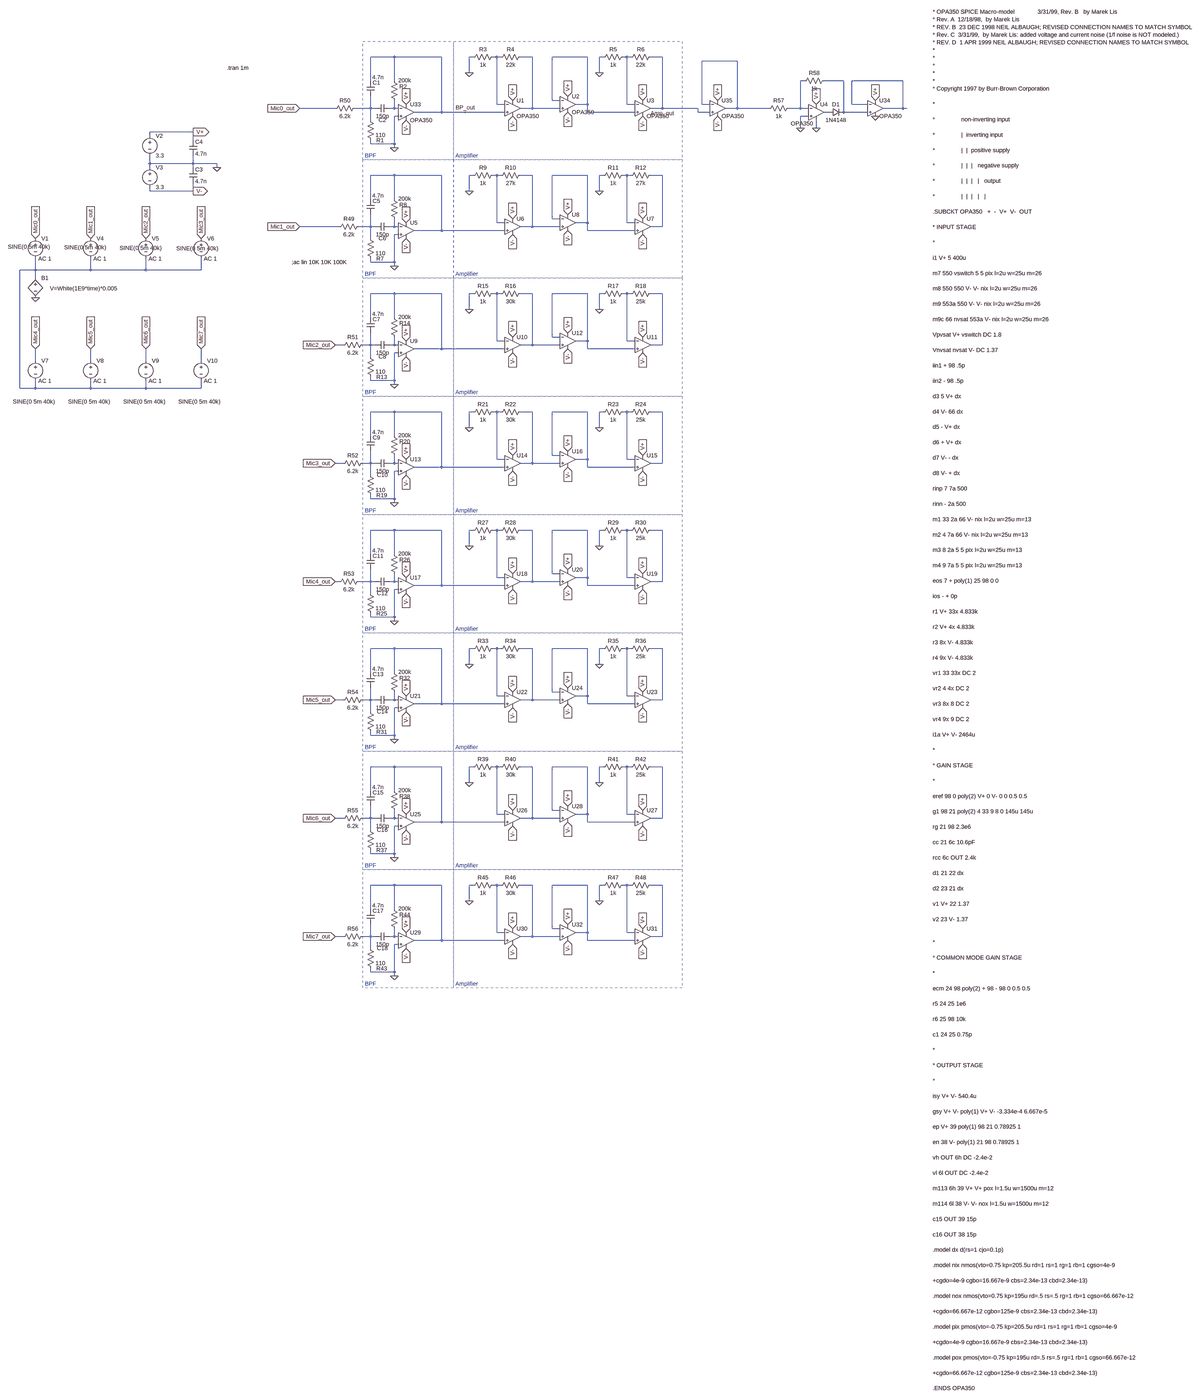
[diagram p0: schematic V00_CircuitDiagram.asc, whole sheet]
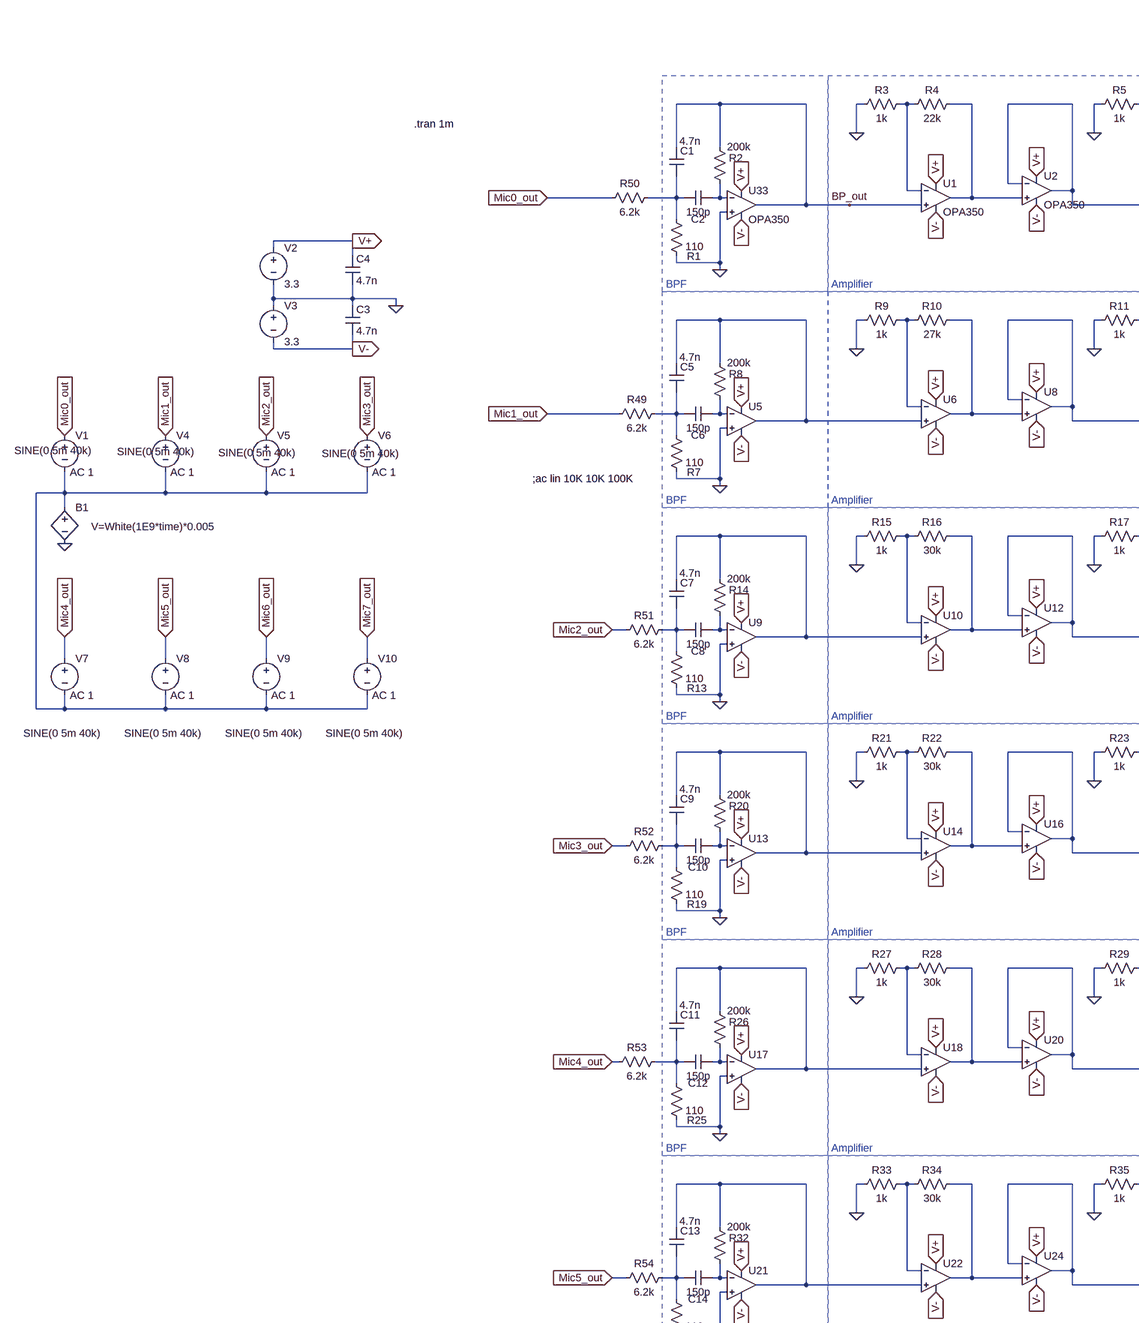
[diagram p1: schematic V00_CircuitDiagram.asc, part, row 1 of 2, column 1 of 2]
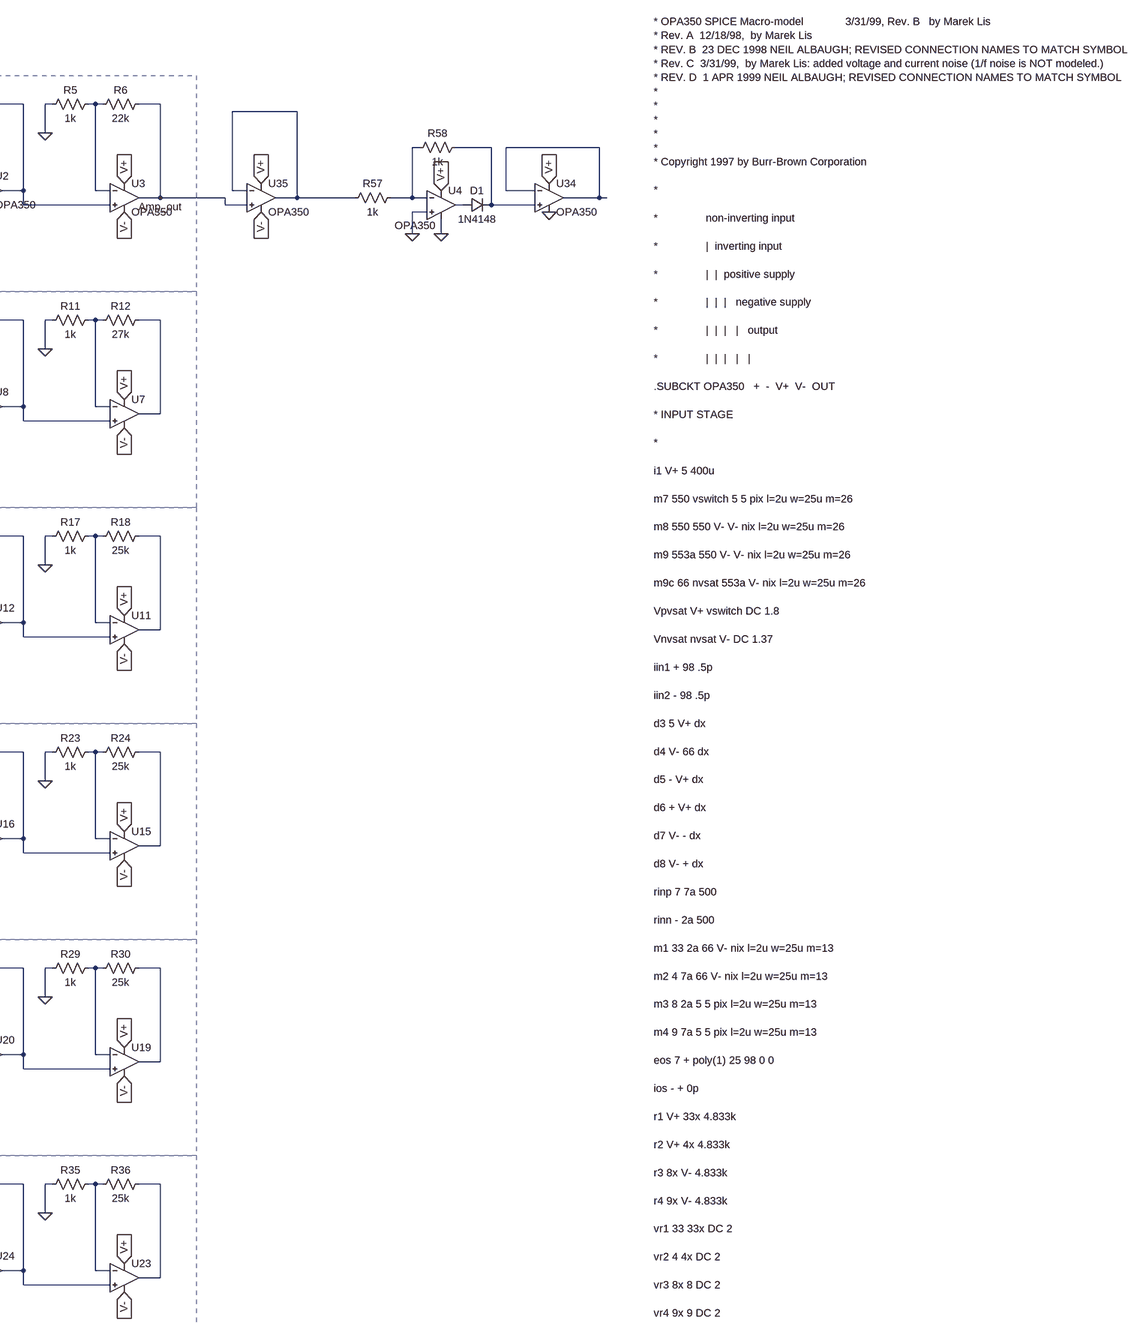
[diagram p2: schematic V00_CircuitDiagram.asc, part, row 1 of 2, column 2 of 2]
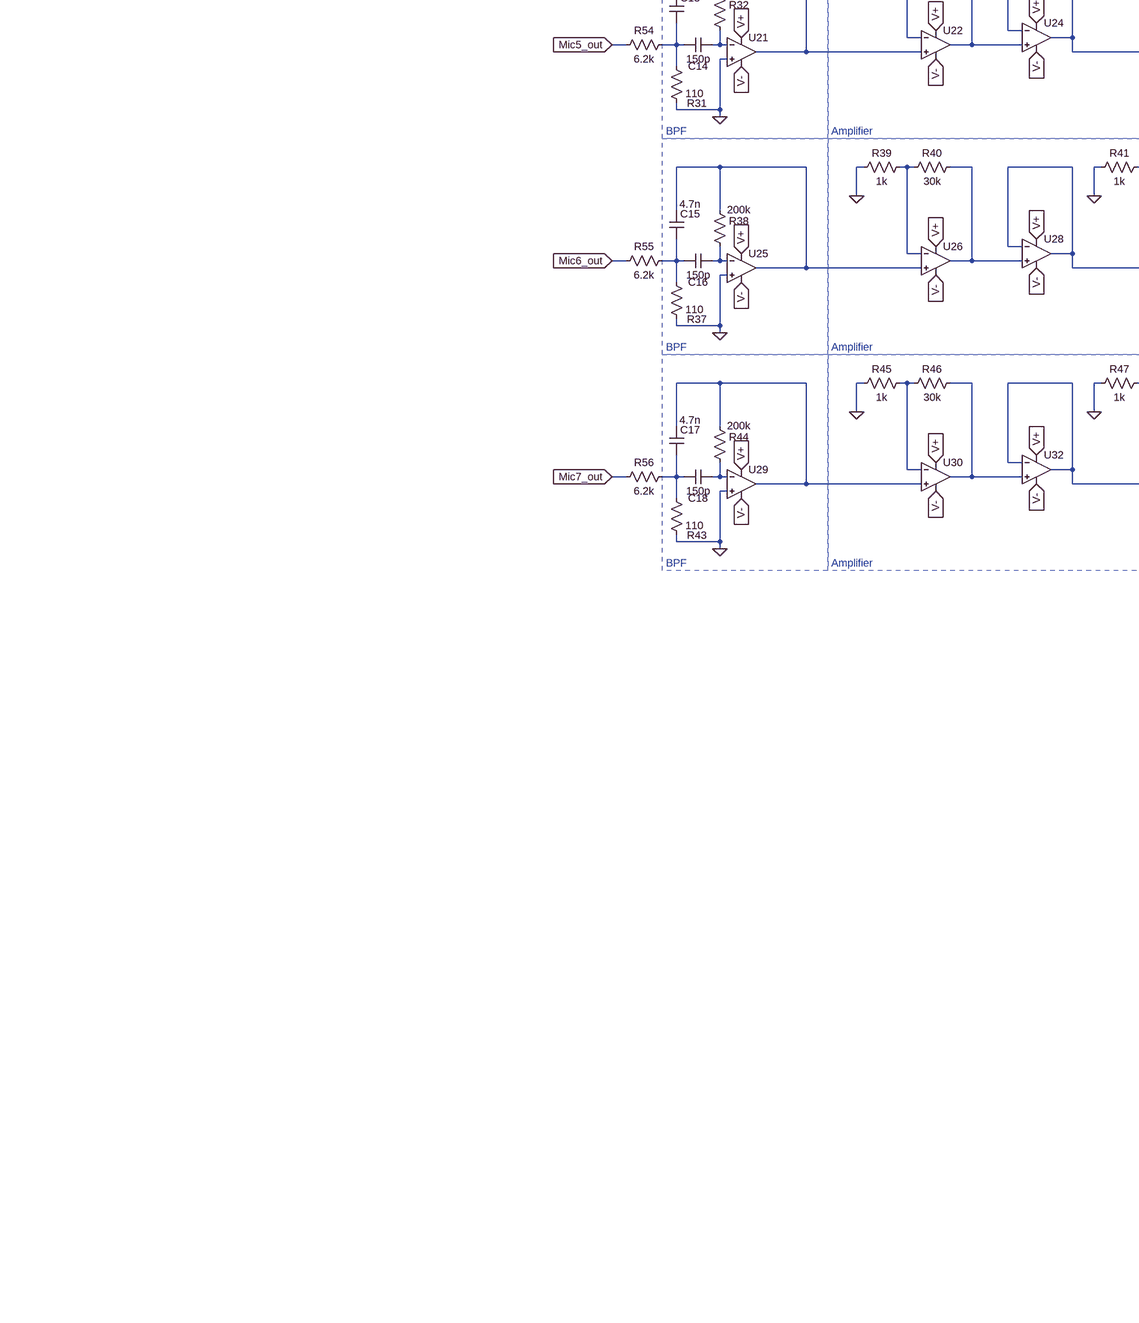
[diagram p3: schematic V00_CircuitDiagram.asc, part, row 2 of 2, column 1 of 2]
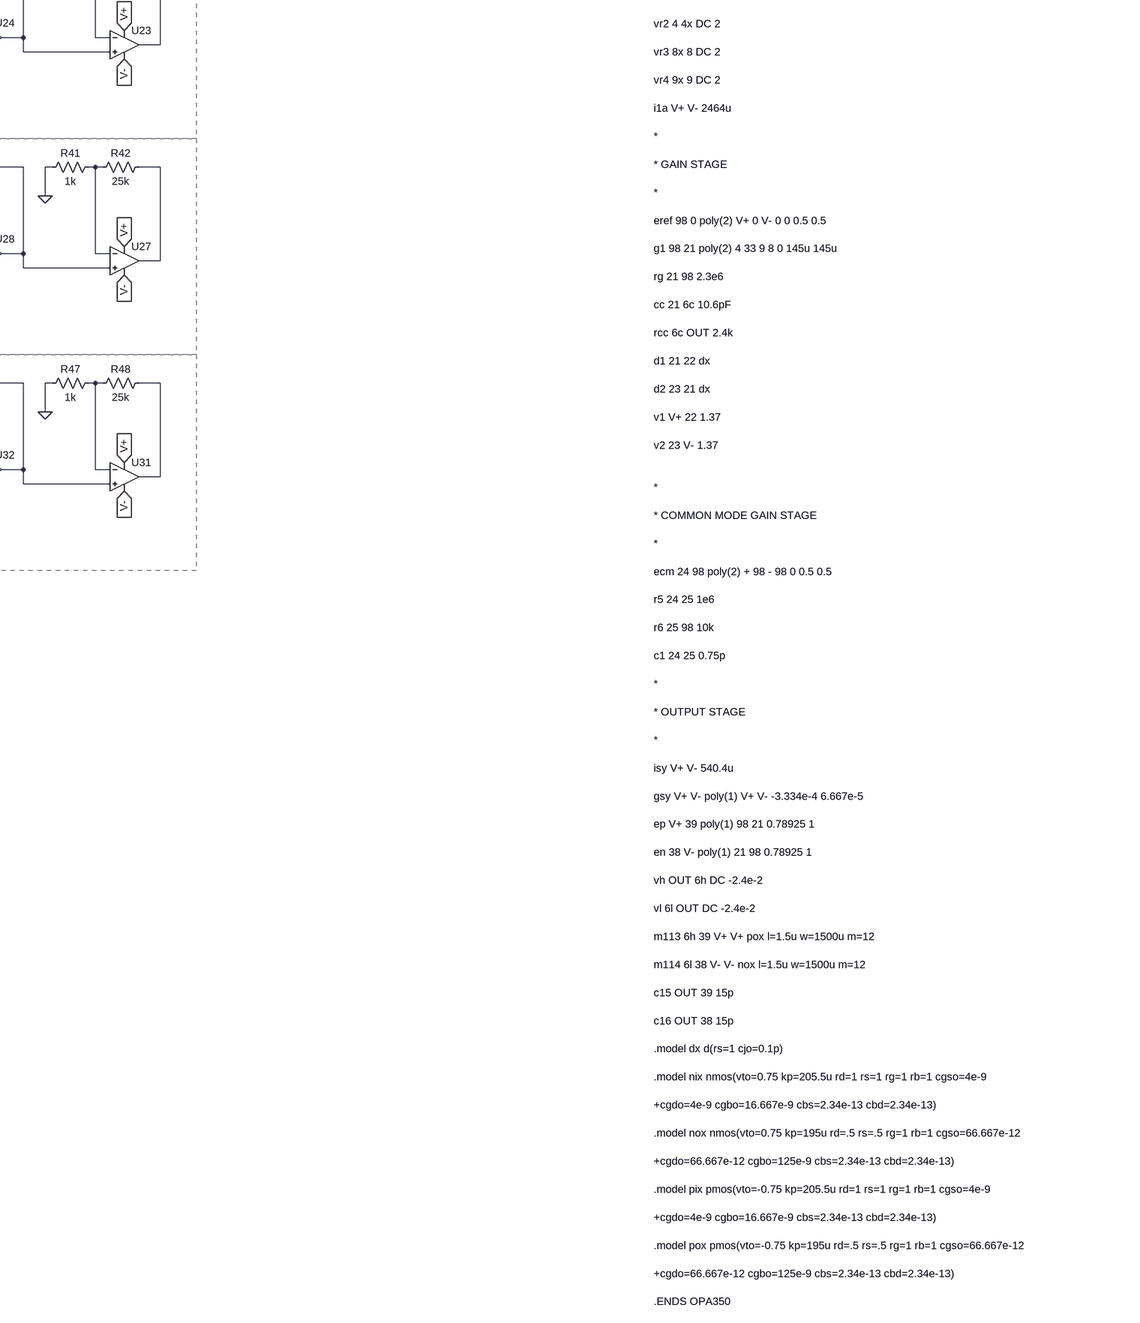
[diagram p4: schematic V00_CircuitDiagram.asc, part, row 2 of 2, column 2 of 2]
V00_CircuitDiagram.asc, the LTspice schematic file:
Version 4
SHEET 1 4744 4672
WIRE 112 -144 16 -144
WIRE 304 -144 112 -144
WIRE 432 -144 416 -144
WIRE 528 -144 512 -144
WIRE 544 -144 528 -144
WIRE 672 -144 624 -144
WIRE 896 -144 752 -144
WIRE 960 -144 944 -144
WIRE 1056 -144 1040 -144
WIRE 1072 -144 1056 -144
WIRE 1200 -144 1152 -144
WIRE 1504 -128 1360 -128
WIRE 416 -80 416 -144
WIRE 944 -80 944 -144
WIRE 16 -48 16 -144
WIRE 112 -48 112 -144
WIRE 1776 -48 1760 -48
WIRE 1936 -48 1856 -48
WIRE 2176 -48 1968 -48
WIRE 752 32 752 -144
WIRE 784 32 752 32
WIRE 528 48 528 -144
WIRE 560 48 528 48
WIRE 896 48 896 -144
WIRE 896 48 848 48
WIRE 1056 48 1056 -144
WIRE 1088 48 1056 48
WIRE 1360 48 1360 -128
WIRE 1392 48 1360 48
WIRE 1968 48 1968 -48
WIRE 2032 48 1968 48
WIRE -128 64 -272 64
WIRE 16 64 16 16
WIRE 16 64 -48 64
WIRE 32 64 16 64
WIRE 112 64 112 32
WIRE 112 64 96 64
WIRE 128 64 112 64
WIRE 672 64 672 -144
WIRE 672 64 624 64
WIRE 784 64 672 64
WIRE 1200 64 1200 -144
WIRE 1200 64 1152 64
WIRE 1344 64 1200 64
WIRE 1504 64 1504 -128
WIRE 1504 64 1456 64
WIRE 1632 64 1504 64
WIRE 1760 64 1760 -48
WIRE 1760 64 1712 64
WIRE 1792 64 1760 64
WIRE 2176 64 2176 -48
WIRE 2176 64 2096 64
WIRE 2192 64 2176 64
WIRE 304 80 304 -144
WIRE 304 80 192 80
WIRE 400 80 304 80
WIRE 560 80 400 80
WIRE 896 80 896 48
WIRE 1088 80 896 80
WIRE 1344 80 1344 64
WIRE 1392 80 1344 80
WIRE 1872 80 1856 80
WIRE 1936 80 1936 -48
WIRE 2032 80 1936 80
WIRE 128 96 112 96
WIRE 1792 96 1760 96
WIRE 16 112 16 64
WIRE 1760 144 1760 96
WIRE 1824 144 1824 112
WIRE -704 160 -880 160
WIRE -880 176 -880 160
WIRE -704 192 -704 160
WIRE 16 208 16 192
WIRE 112 208 112 96
WIRE 112 208 16 208
WIRE 112 224 112 208
WIRE -880 288 -880 256
WIRE -704 288 -704 256
WIRE -704 288 -880 288
WIRE -608 288 -704 288
WIRE -880 304 -880 288
WIRE -704 304 -704 288
WIRE -608 304 -608 288
WIRE 112 336 16 336
WIRE 304 336 112 336
WIRE 432 336 416 336
WIRE 528 336 512 336
WIRE 544 336 528 336
WIRE 672 336 624 336
WIRE 896 336 752 336
WIRE 960 336 944 336
WIRE 1056 336 1040 336
WIRE 1072 336 1056 336
WIRE 1200 336 1152 336
WIRE -880 400 -880 384
WIRE -704 400 -704 368
WIRE -704 400 -880 400
WIRE 416 400 416 336
WIRE 944 400 944 336
WIRE 16 432 16 336
WIRE 112 432 112 336
WIRE 752 512 752 336
WIRE 784 512 752 512
WIRE 528 528 528 336
WIRE 560 528 528 528
WIRE 896 528 896 336
WIRE 896 528 848 528
WIRE 1056 528 1056 336
WIRE 1088 528 1056 528
WIRE -112 544 -272 544
WIRE 16 544 16 496
WIRE 16 544 -32 544
WIRE 32 544 16 544
WIRE 112 544 112 512
WIRE 112 544 96 544
WIRE 128 544 112 544
WIRE 672 544 672 336
WIRE 672 544 624 544
WIRE 784 544 672 544
WIRE 1200 544 1200 336
WIRE 1200 544 1152 544
WIRE 304 560 304 336
WIRE 304 560 192 560
WIRE 560 560 304 560
WIRE 896 560 896 528
WIRE 1088 560 896 560
WIRE 128 576 112 576
WIRE 16 592 16 544
WIRE 16 688 16 672
WIRE 112 688 112 576
WIRE 112 688 16 688
WIRE 112 704 112 688
WIRE -1344 720 -1344 672
WIRE -1344 720 -1408 720
WIRE -1120 720 -1120 672
WIRE -1120 720 -1344 720
WIRE -896 720 -896 672
WIRE -896 720 -1120 720
WIRE -672 720 -672 672
WIRE -672 720 -896 720
WIRE -1344 752 -1344 720
WIRE 112 816 16 816
WIRE 304 816 112 816
WIRE 432 816 416 816
WIRE 528 816 512 816
WIRE 544 816 528 816
WIRE 672 816 624 816
WIRE 896 816 752 816
WIRE 960 816 944 816
WIRE 1056 816 1040 816
WIRE 1072 816 1056 816
WIRE 1200 816 1152 816
WIRE 416 880 416 816
WIRE 944 880 944 816
WIRE 16 912 16 816
WIRE 112 912 112 816
WIRE 752 992 752 816
WIRE 784 992 752 992
WIRE 528 1008 528 816
WIRE 560 1008 528 1008
WIRE 896 1008 896 816
WIRE 896 1008 848 1008
WIRE 1056 1008 1056 816
WIRE 1088 1008 1056 1008
WIRE -96 1024 -128 1024
WIRE 16 1024 16 976
WIRE 16 1024 -16 1024
WIRE 32 1024 16 1024
WIRE 112 1024 112 992
WIRE 112 1024 96 1024
WIRE 128 1024 112 1024
WIRE 672 1024 672 816
WIRE 672 1024 624 1024
WIRE 784 1024 672 1024
WIRE 1200 1024 1200 816
WIRE 1200 1024 1152 1024
WIRE 304 1040 304 816
WIRE 304 1040 192 1040
WIRE 560 1040 304 1040
WIRE 896 1040 896 1008
WIRE 1088 1040 896 1040
WIRE 128 1056 112 1056
WIRE 16 1072 16 1024
WIRE -1344 1088 -1344 1040
WIRE -1120 1088 -1120 1040
WIRE -896 1088 -896 1040
WIRE -672 1088 -672 1040
WIRE 16 1168 16 1152
WIRE 112 1168 112 1056
WIRE 112 1168 16 1168
WIRE 112 1184 112 1168
WIRE -1408 1200 -1408 720
WIRE -1344 1200 -1344 1168
WIRE -1344 1200 -1408 1200
WIRE -1120 1200 -1120 1168
WIRE -1120 1200 -1344 1200
WIRE -896 1200 -896 1168
WIRE -896 1200 -1120 1200
WIRE -672 1200 -672 1168
WIRE -672 1200 -896 1200
WIRE 112 1296 16 1296
WIRE 304 1296 112 1296
WIRE 432 1296 416 1296
WIRE 528 1296 512 1296
WIRE 544 1296 528 1296
WIRE 672 1296 624 1296
WIRE 896 1296 752 1296
WIRE 960 1296 944 1296
WIRE 1056 1296 1040 1296
WIRE 1072 1296 1056 1296
WIRE 1200 1296 1152 1296
WIRE 416 1360 416 1296
WIRE 944 1360 944 1296
WIRE 16 1392 16 1296
WIRE 112 1392 112 1296
WIRE 752 1472 752 1296
WIRE 784 1472 752 1472
WIRE 528 1488 528 1296
WIRE 560 1488 528 1488
WIRE 896 1488 896 1296
WIRE 896 1488 848 1488
WIRE 1056 1488 1056 1296
WIRE 1088 1488 1056 1488
WIRE -96 1504 -128 1504
WIRE 16 1504 16 1456
WIRE 16 1504 -16 1504
WIRE 32 1504 16 1504
WIRE 112 1504 112 1472
WIRE 112 1504 96 1504
WIRE 128 1504 112 1504
WIRE 672 1504 672 1296
WIRE 672 1504 624 1504
WIRE 784 1504 672 1504
WIRE 1200 1504 1200 1296
WIRE 1200 1504 1152 1504
WIRE 304 1520 304 1296
WIRE 304 1520 192 1520
WIRE 560 1520 304 1520
WIRE 896 1520 896 1488
WIRE 1088 1520 896 1520
WIRE 128 1536 112 1536
WIRE 16 1552 16 1504
WIRE 16 1648 16 1632
WIRE 112 1648 112 1536
WIRE 112 1648 16 1648
WIRE 112 1664 112 1648
WIRE 112 1776 16 1776
WIRE 304 1776 112 1776
WIRE 432 1776 416 1776
WIRE 528 1776 512 1776
WIRE 544 1776 528 1776
WIRE 672 1776 624 1776
WIRE 896 1776 752 1776
WIRE 960 1776 944 1776
WIRE 1056 1776 1040 1776
WIRE 1072 1776 1056 1776
WIRE 1200 1776 1152 1776
WIRE 416 1840 416 1776
WIRE 944 1840 944 1776
WIRE 16 1872 16 1776
WIRE 112 1872 112 1776
WIRE 752 1952 752 1776
WIRE 784 1952 752 1952
WIRE 528 1968 528 1776
WIRE 560 1968 528 1968
WIRE 896 1968 896 1776
WIRE 896 1968 848 1968
WIRE 1056 1968 1056 1776
WIRE 1088 1968 1056 1968
WIRE -112 1984 -128 1984
WIRE 16 1984 16 1936
WIRE 16 1984 -32 1984
WIRE 32 1984 16 1984
WIRE 112 1984 112 1952
WIRE 112 1984 96 1984
WIRE 128 1984 112 1984
WIRE 672 1984 672 1776
WIRE 672 1984 624 1984
WIRE 784 1984 672 1984
WIRE 1200 1984 1200 1776
WIRE 1200 1984 1152 1984
WIRE 304 2000 304 1776
WIRE 304 2000 192 2000
WIRE 560 2000 304 2000
WIRE 896 2000 896 1968
WIRE 1088 2000 896 2000
WIRE 128 2016 112 2016
WIRE 16 2032 16 1984
WIRE 16 2128 16 2112
WIRE 112 2128 112 2016
WIRE 112 2128 16 2128
WIRE 112 2144 112 2128
WIRE 112 2256 16 2256
WIRE 304 2256 112 2256
WIRE 432 2256 416 2256
WIRE 528 2256 512 2256
WIRE 544 2256 528 2256
WIRE 672 2256 624 2256
WIRE 896 2256 752 2256
WIRE 960 2256 944 2256
WIRE 1056 2256 1040 2256
WIRE 1072 2256 1056 2256
WIRE 1200 2256 1152 2256
WIRE 416 2320 416 2256
WIRE 944 2320 944 2256
WIRE 16 2352 16 2256
WIRE 112 2352 112 2256
WIRE 752 2432 752 2256
WIRE 784 2432 752 2432
WIRE 528 2448 528 2256
WIRE 560 2448 528 2448
WIRE 896 2448 896 2256
WIRE 896 2448 848 2448
WIRE 1056 2448 1056 2256
WIRE 1088 2448 1056 2448
WIRE -96 2464 -128 2464
WIRE 16 2464 16 2416
WIRE 16 2464 -16 2464
WIRE 32 2464 16 2464
WIRE 112 2464 112 2432
WIRE 112 2464 96 2464
WIRE 128 2464 112 2464
WIRE 672 2464 672 2256
WIRE 672 2464 624 2464
WIRE 784 2464 672 2464
WIRE 1200 2464 1200 2256
WIRE 1200 2464 1152 2464
WIRE 304 2480 304 2256
WIRE 304 2480 192 2480
WIRE 560 2480 304 2480
WIRE 896 2480 896 2448
WIRE 1088 2480 896 2480
WIRE 128 2496 112 2496
WIRE 16 2512 16 2464
WIRE 16 2608 16 2592
WIRE 112 2608 112 2496
WIRE 112 2608 16 2608
WIRE 112 2624 112 2608
WIRE 112 2736 16 2736
WIRE 304 2736 112 2736
WIRE 432 2736 416 2736
WIRE 528 2736 512 2736
WIRE 544 2736 528 2736
WIRE 672 2736 624 2736
WIRE 896 2736 752 2736
WIRE 960 2736 944 2736
WIRE 1056 2736 1040 2736
WIRE 1072 2736 1056 2736
WIRE 1200 2736 1152 2736
WIRE 416 2800 416 2736
WIRE 944 2800 944 2736
WIRE 16 2832 16 2736
WIRE 112 2832 112 2736
WIRE 752 2912 752 2736
WIRE 784 2912 752 2912
WIRE 528 2928 528 2736
WIRE 560 2928 528 2928
WIRE 896 2928 896 2736
WIRE 896 2928 848 2928
WIRE 1056 2928 1056 2736
WIRE 1088 2928 1056 2928
WIRE -96 2944 -128 2944
WIRE 16 2944 16 2896
WIRE 16 2944 -16 2944
WIRE 32 2944 16 2944
WIRE 112 2944 112 2912
WIRE 112 2944 96 2944
WIRE 128 2944 112 2944
WIRE 672 2944 672 2736
WIRE 672 2944 624 2944
WIRE 784 2944 672 2944
WIRE 1200 2944 1200 2736
WIRE 1200 2944 1152 2944
WIRE 304 2960 304 2736
WIRE 304 2960 192 2960
WIRE 560 2960 304 2960
WIRE 896 2960 896 2928
WIRE 1088 2960 896 2960
WIRE 128 2976 112 2976
WIRE 16 2992 16 2944
WIRE 16 3088 16 3072
WIRE 112 3088 112 2976
WIRE 112 3088 16 3088
WIRE 112 3104 112 3088
WIRE 112 3216 16 3216
WIRE 304 3216 112 3216
WIRE 432 3216 416 3216
WIRE 528 3216 512 3216
WIRE 544 3216 528 3216
WIRE 672 3216 624 3216
WIRE 896 3216 752 3216
WIRE 960 3216 944 3216
WIRE 1056 3216 1040 3216
WIRE 1072 3216 1056 3216
WIRE 1200 3216 1152 3216
WIRE 416 3280 416 3216
WIRE 944 3280 944 3216
WIRE 16 3312 16 3216
WIRE 112 3312 112 3216
WIRE 752 3392 752 3216
WIRE 784 3392 752 3392
WIRE 528 3408 528 3216
WIRE 560 3408 528 3408
WIRE 896 3408 896 3216
WIRE 896 3408 848 3408
WIRE 1056 3408 1056 3216
WIRE 1088 3408 1056 3408
WIRE -96 3424 -128 3424
WIRE 16 3424 16 3376
WIRE 16 3424 -16 3424
WIRE 32 3424 16 3424
WIRE 112 3424 112 3392
WIRE 112 3424 96 3424
WIRE 128 3424 112 3424
WIRE 672 3424 672 3216
WIRE 672 3424 624 3424
WIRE 784 3424 672 3424
WIRE 1200 3424 1200 3216
WIRE 1200 3424 1152 3424
WIRE 304 3440 304 3216
WIRE 304 3440 192 3440
WIRE 560 3440 304 3440
WIRE 896 3440 896 3408
WIRE 1088 3440 896 3440
WIRE 128 3456 112 3456
WIRE 16 3472 16 3424
WIRE 16 3568 16 3552
WIRE 112 3568 112 3456
WIRE 112 3568 16 3568
WIRE 112 3584 112 3568
FLAG 112 224 0
FLAG -608 304 0
FLAG -704 400 V-
IOPIN -704 400 Out
FLAG 160 112 V-
IOPIN 160 112 In
FLAG -704 160 V+
IOPIN -704 160 Out
FLAG 160 48 V+
IOPIN 160 48 In
FLAG -272 64 Mic0_out
IOPIN -272 64 In
FLAG 416 -80 0
FLAG 944 -80 0
FLAG 592 32 V+
IOPIN 592 32 In
FLAG 816 16 V+
IOPIN 816 16 In
FLAG 1120 32 V+
IOPIN 1120 32 In
FLAG -1344 592 Mic0_out
IOPIN -1344 592 In
FLAG -1344 832 0
FLAG 112 704 0
FLAG 160 592 V-
IOPIN 160 592 In
FLAG 160 528 V+
IOPIN 160 528 In
FLAG 416 400 0
FLAG 944 400 0
FLAG 592 512 V+
IOPIN 592 512 In
FLAG 816 496 V+
IOPIN 816 496 In
FLAG 1120 512 V+
IOPIN 1120 512 In
FLAG 592 576 V-
IOPIN 592 576 In
FLAG 816 560 V-
IOPIN 816 560 In
FLAG 1120 576 V-
IOPIN 1120 576 In
FLAG 112 1184 0
FLAG 160 1072 V-
IOPIN 160 1072 In
FLAG 160 1008 V+
IOPIN 160 1008 In
FLAG 416 880 0
FLAG 944 880 0
FLAG 592 992 V+
IOPIN 592 992 In
FLAG 816 976 V+
IOPIN 816 976 In
FLAG 1120 992 V+
IOPIN 1120 992 In
FLAG 592 1056 V-
IOPIN 592 1056 In
FLAG 816 1040 V-
IOPIN 816 1040 In
FLAG 1120 1056 V-
IOPIN 1120 1056 In
FLAG 112 1664 0
FLAG 160 1552 V-
IOPIN 160 1552 In
FLAG 160 1488 V+
IOPIN 160 1488 In
FLAG 416 1360 0
FLAG 944 1360 0
FLAG 592 1472 V+
IOPIN 592 1472 In
FLAG 816 1456 V+
IOPIN 816 1456 In
FLAG 1120 1472 V+
IOPIN 1120 1472 In
FLAG 592 1536 V-
IOPIN 592 1536 In
FLAG 816 1520 V-
IOPIN 816 1520 In
FLAG 1120 1536 V-
IOPIN 1120 1536 In
FLAG 112 2144 0
FLAG 160 2032 V-
IOPIN 160 2032 In
FLAG 160 1968 V+
IOPIN 160 1968 In
FLAG 416 1840 0
FLAG 944 1840 0
FLAG 592 1952 V+
IOPIN 592 1952 In
FLAG 816 1936 V+
IOPIN 816 1936 In
FLAG 1120 1952 V+
IOPIN 1120 1952 In
FLAG 592 2016 V-
IOPIN 592 2016 In
FLAG 816 2000 V-
IOPIN 816 2000 In
FLAG 1120 2016 V-
IOPIN 1120 2016 In
FLAG 112 2624 0
FLAG 160 2512 V-
IOPIN 160 2512 In
FLAG 160 2448 V+
IOPIN 160 2448 In
FLAG 416 2320 0
FLAG 944 2320 0
FLAG 592 2432 V+
IOPIN 592 2432 In
FLAG 816 2416 V+
IOPIN 816 2416 In
FLAG 1120 2432 V+
IOPIN 1120 2432 In
FLAG 592 2496 V-
IOPIN 592 2496 In
FLAG 816 2480 V-
IOPIN 816 2480 In
FLAG 1120 2496 V-
IOPIN 1120 2496 In
FLAG 112 3104 0
FLAG 160 2992 V-
IOPIN 160 2992 In
FLAG 160 2928 V+
IOPIN 160 2928 In
FLAG 416 2800 0
FLAG 944 2800 0
FLAG 592 2912 V+
IOPIN 592 2912 In
FLAG 816 2896 V+
IOPIN 816 2896 In
FLAG 1120 2912 V+
IOPIN 1120 2912 In
FLAG 592 2976 V-
IOPIN 592 2976 In
FLAG 816 2960 V-
IOPIN 816 2960 In
FLAG 1120 2976 V-
IOPIN 1120 2976 In
FLAG 112 3584 0
FLAG 160 3472 V-
IOPIN 160 3472 In
FLAG 160 3408 V+
IOPIN 160 3408 In
FLAG 416 3280 0
FLAG 944 3280 0
FLAG 592 3392 V+
IOPIN 592 3392 In
FLAG 816 3376 V+
IOPIN 816 3376 In
FLAG 1120 3392 V+
IOPIN 1120 3392 In
FLAG 592 3456 V-
IOPIN 592 3456 In
FLAG 816 3440 V-
IOPIN 816 3440 In
FLAG 1120 3456 V-
IOPIN 1120 3456 In
FLAG -1120 592 Mic1_out
IOPIN -1120 592 In
FLAG -896 592 Mic2_out
IOPIN -896 592 In
FLAG -672 592 Mic3_out
IOPIN -672 592 In
FLAG -1344 1040 Mic4_out
IOPIN -1344 1040 In
FLAG -1120 1040 Mic5_out
IOPIN -1120 1040 In
FLAG -896 1040 Mic6_out
IOPIN -896 1040 In
FLAG -672 1040 Mic7_out
IOPIN -672 1040 In
FLAG -272 544 Mic1_out
IOPIN -272 544 In
FLAG -128 1024 Mic2_out
IOPIN -128 1024 In
FLAG -128 1504 Mic3_out
IOPIN -128 1504 In
FLAG -128 1984 Mic4_out
IOPIN -128 1984 In
FLAG -128 2464 Mic5_out
IOPIN -128 2464 In
FLAG -128 2944 Mic6_out
IOPIN -128 2944 In
FLAG -128 3424 Mic7_out
IOPIN -128 3424 In
FLAG 400 80 BP_out
FLAG 1200 64 Amp_out
FLAG 592 96 V-
IOPIN 592 96 In
FLAG 816 80 V-
IOPIN 816 80 In
FLAG 1120 96 V-
IOPIN 1120 96 In
FLAG 1760 144 0
FLAG 1824 144 0
FLAG 2064 96 0
FLAG 1824 48 V+
IOPIN 1824 48 In
FLAG 2064 32 V+
IOPIN 2064 32 In
FLAG 1424 32 V+
IOPIN 1424 32 In
FLAG 1424 96 V-
IOPIN 1424 96 In
SYMBOL cap 0 -48 R0
WINDOW 3 22 -14 Left 2
SYMATTR InstName C1
SYMATTR Value 4.7n
SYMBOL cap 96 48 R90
WINDOW 0 79 32 VBottom 2
WINDOW 3 32 32 VTop 2
SYMATTR InstName C2
SYMATTR Value 150p
SYMBOL res 0 96 R0
WINDOW 0 39 98 Left 2
SYMATTR InstName R1
SYMATTR Value 110
SYMBOL res 96 -64 R0
WINDOW 3 32 15 Left 2
SYMATTR InstName R2
SYMATTR Value 200k
SYMBOL voltage -880 160 R0
WINDOW 123 0 0 Left 0
WINDOW 39 0 0 Left 0
SYMATTR InstName V2
SYMATTR Value 3.3
SYMBOL voltage -880 288 R0
WINDOW 123 0 0 Left 0
WINDOW 39 0 0 Left 0
SYMATTR InstName V3
SYMATTR Value 3.3
SYMBOL cap -720 304 R0
SYMATTR InstName C3
SYMATTR Value 4.7n
SYMBOL cap -720 192 R0
SYMATTR InstName C4
SYMATTR Value 4.7n
SYMBOL res 528 -160 R90
WINDOW 0 0 56 VBottom 2
WINDOW 3 32 56 VTop 2
SYMATTR InstName R3
SYMATTR Value 1k
SYMBOL res 640 -160 R90
WINDOW 0 0 56 VBottom 2
WINDOW 3 32 56 VTop 2
SYMATTR InstName R4
SYMATTR Value 22k
SYMBOL res 1056 -160 R90
WINDOW 0 0 56 VBottom 2
WINDOW 3 32 56 VTop 2
SYMATTR InstName R5
SYMATTR Value 1k
SYMBOL res 1168 -160 R90
WINDOW 0 0 56 VBottom 2
WINDOW 3 32 56 VTop 2
SYMATTR InstName R6
SYMATTR Value 22k
SYMBOL voltage -1344 576 R0
WINDOW 3 -112 50 Left 2
WINDOW 123 11 98 Left 2
WINDOW 39 0 0 Left 0
SYMATTR InstName V1
SYMATTR Value SINE(0 5m 40k)
SYMATTR Value2 AC 1
SYMBOL OpAmps\\UniversalOpAmp 160 560 R0
SYMATTR InstName U5
SYMBOL cap 0 432 R0
WINDOW 3 22 -14 Left 2
SYMATTR InstName C5
SYMATTR Value 4.7n
SYMBOL cap 96 528 R90
WINDOW 0 79 32 VBottom 2
WINDOW 3 32 32 VTop 2
SYMATTR InstName C6
SYMATTR Value 150p
SYMBOL res 0 576 R0
WINDOW 0 39 98 Left 2
SYMATTR InstName R7
SYMATTR Value 110
SYMBOL res 96 416 R0
WINDOW 3 32 15 Left 2
SYMATTR InstName R8
SYMATTR Value 200k
SYMBOL OpAmps\\UniversalOpAmp 592 544 R0
SYMATTR InstName U6
SYMBOL res 528 320 R90
WINDOW 0 0 56 VBottom 2
WINDOW 3 32 56 VTop 2
SYMATTR InstName R9
SYMATTR Value 1k
SYMBOL res 640 320 R90
WINDOW 0 0 56 VBottom 2
WINDOW 3 32 56 VTop 2
SYMATTR InstName R10
SYMATTR Value 27k
SYMBOL OpAmps\\UniversalOpAmp 1120 544 R0
SYMATTR InstName U7
SYMBOL res 1056 320 R90
WINDOW 0 0 56 VBottom 2
WINDOW 3 32 56 VTop 2
SYMATTR InstName R11
SYMATTR Value 1k
SYMBOL res 1168 320 R90
WINDOW 0 0 56 VBottom 2
WINDOW 3 32 56 VTop 2
SYMATTR InstName R12
SYMATTR Value 27k
SYMBOL OpAmps\\UniversalOpAmp 816 528 R0
SYMATTR InstName U8
SYMBOL OpAmps\\UniversalOpAmp 160 1040 R0
SYMATTR InstName U9
SYMBOL cap 0 912 R0
WINDOW 3 22 -14 Left 2
SYMATTR InstName C7
SYMATTR Value 4.7n
SYMBOL cap 96 1008 R90
WINDOW 0 79 32 VBottom 2
WINDOW 3 32 32 VTop 2
SYMATTR InstName C8
SYMATTR Value 150p
SYMBOL res 0 1056 R0
WINDOW 0 39 98 Left 2
SYMATTR InstName R13
SYMATTR Value 110
SYMBOL res 96 896 R0
WINDOW 3 32 15 Left 2
SYMATTR InstName R14
SYMATTR Value 200k
SYMBOL OpAmps\\UniversalOpAmp 592 1024 R0
SYMATTR InstName U10
SYMBOL res 528 800 R90
WINDOW 0 0 56 VBottom 2
WINDOW 3 32 56 VTop 2
SYMATTR InstName R15
SYMATTR Value 1k
SYMBOL res 640 800 R90
WINDOW 0 0 56 VBottom 2
WINDOW 3 32 56 VTop 2
SYMATTR InstName R16
SYMATTR Value 30k
SYMBOL OpAmps\\UniversalOpAmp 1120 1024 R0
SYMATTR InstName U11
SYMBOL res 1056 800 R90
WINDOW 0 0 56 VBottom 2
WINDOW 3 32 56 VTop 2
SYMATTR InstName R17
SYMATTR Value 1k
SYMBOL res 1168 800 R90
WINDOW 0 0 56 VBottom 2
WINDOW 3 32 56 VTop 2
SYMATTR InstName R18
SYMATTR Value 25k
SYMBOL OpAmps\\UniversalOpAmp 816 1008 R0
SYMATTR InstName U12
SYMBOL OpAmps\\UniversalOpAmp 160 1520 R0
SYMATTR InstName U13
SYMBOL cap 0 1392 R0
WINDOW 3 22 -14 Left 2
SYMATTR InstName C9
SYMATTR Value 4.7n
SYMBOL cap 96 1488 R90
WINDOW 0 79 32 VBottom 2
WINDOW 3 32 32 VTop 2
SYMATTR InstName C10
SYMATTR Value 150p
SYMBOL res 0 1536 R0
WINDOW 0 39 98 Left 2
SYMATTR InstName R19
SYMATTR Value 110
SYMBOL res 96 1376 R0
WINDOW 3 32 15 Left 2
SYMATTR InstName R20
SYMATTR Value 200k
SYMBOL OpAmps\\UniversalOpAmp 592 1504 R0
SYMATTR InstName U14
SYMBOL res 528 1280 R90
WINDOW 0 0 56 VBottom 2
WINDOW 3 32 56 VTop 2
SYMATTR InstName R21
SYMATTR Value 1k
SYMBOL res 640 1280 R90
WINDOW 0 0 56 VBottom 2
WINDOW 3 32 56 VTop 2
SYMATTR InstName R22
SYMATTR Value 30k
SYMBOL OpAmps\\UniversalOpAmp 1120 1504 R0
SYMATTR InstName U15
SYMBOL res 1056 1280 R90
WINDOW 0 0 56 VBottom 2
WINDOW 3 32 56 VTop 2
SYMATTR InstName R23
SYMATTR Value 1k
SYMBOL res 1168 1280 R90
WINDOW 0 0 56 VBottom 2
WINDOW 3 32 56 VTop 2
SYMATTR InstName R24
SYMATTR Value 25k
SYMBOL OpAmps\\UniversalOpAmp 816 1488 R0
SYMATTR InstName U16
SYMBOL OpAmps\\UniversalOpAmp 160 2000 R0
SYMATTR InstName U17
SYMBOL cap 0 1872 R0
WINDOW 3 22 -14 Left 2
SYMATTR InstName C11
SYMATTR Value 4.7n
SYMBOL cap 96 1968 R90
WINDOW 0 79 32 VBottom 2
WINDOW 3 32 32 VTop 2
SYMATTR InstName C12
SYMATTR Value 150p
SYMBOL res 0 2016 R0
WINDOW 0 39 98 Left 2
SYMATTR InstName R25
SYMATTR Value 110
SYMBOL res 96 1856 R0
WINDOW 3 32 15 Left 2
SYMATTR InstName R26
SYMATTR Value 200k
SYMBOL OpAmps\\UniversalOpAmp 592 1984 R0
SYMATTR InstName U18
SYMBOL res 528 1760 R90
WINDOW 0 0 56 VBottom 2
WINDOW 3 32 56 VTop 2
SYMATTR InstName R27
SYMATTR Value 1k
SYMBOL res 640 1760 R90
WINDOW 0 0 56 VBottom 2
WINDOW 3 32 56 VTop 2
SYMATTR InstName R28
SYMATTR Value 30k
SYMBOL OpAmps\\UniversalOpAmp 1120 1984 R0
SYMATTR InstName U19
SYMBOL res 1056 1760 R90
WINDOW 0 0 56 VBottom 2
WINDOW 3 32 56 VTop 2
SYMATTR InstName R29
SYMATTR Value 1k
SYMBOL res 1168 1760 R90
WINDOW 0 0 56 VBottom 2
WINDOW 3 32 56 VTop 2
SYMATTR InstName R30
SYMATTR Value 25k
SYMBOL OpAmps\\UniversalOpAmp 816 1968 R0
SYMATTR InstName U20
SYMBOL OpAmps\\UniversalOpAmp 160 2480 R0
SYMATTR InstName U21
SYMBOL cap 0 2352 R0
WINDOW 3 22 -14 Left 2
SYMATTR InstName C13
SYMATTR Value 4.7n
SYMBOL cap 96 2448 R90
WINDOW 0 79 32 VBottom 2
WINDOW 3 32 32 VTop 2
SYMATTR InstName C14
SYMATTR Value 150p
SYMBOL res 0 2496 R0
WINDOW 0 39 98 Left 2
SYMATTR InstName R31
SYMATTR Value 110
SYMBOL res 96 2336 R0
WINDOW 3 32 15 Left 2
SYMATTR InstName R32
SYMATTR Value 200k
SYMBOL OpAmps\\UniversalOpAmp 592 2464 R0
SYMATTR InstName U22
SYMBOL res 528 2240 R90
WINDOW 0 0 56 VBottom 2
WINDOW 3 32 56 VTop 2
SYMATTR InstName R33
SYMATTR Value 1k
SYMBOL res 640 2240 R90
WINDOW 0 0 56 VBottom 2
WINDOW 3 32 56 VTop 2
SYMATTR InstName R34
SYMATTR Value 30k
SYMBOL OpAmps\\UniversalOpAmp 1120 2464 R0
SYMATTR InstName U23
SYMBOL res 1056 2240 R90
WINDOW 0 0 56 VBottom 2
WINDOW 3 32 56 VTop 2
SYMATTR InstName R35
SYMATTR Value 1k
SYMBOL res 1168 2240 R90
WINDOW 0 0 56 VBottom 2
WINDOW 3 32 56 VTop 2
SYMATTR InstName R36
SYMATTR Value 25k
SYMBOL OpAmps\\UniversalOpAmp 816 2448 R0
SYMATTR InstName U24
SYMBOL OpAmps\\UniversalOpAmp 160 2960 R0
SYMATTR InstName U25
SYMBOL cap 0 2832 R0
WINDOW 3 22 -14 Left 2
SYMATTR InstName C15
SYMATTR Value 4.7n
SYMBOL cap 96 2928 R90
WINDOW 0 79 32 VBottom 2
WINDOW 3 32 32 VTop 2
SYMATTR InstName C16
SYMATTR Value 150p
SYMBOL res 0 2976 R0
WINDOW 0 39 98 Left 2
SYMATTR InstName R37
SYMATTR Value 110
SYMBOL res 96 2816 R0
WINDOW 3 32 15 Left 2
SYMATTR InstName R38
SYMATTR Value 200k
SYMBOL OpAmps\\UniversalOpAmp 592 2944 R0
SYMATTR InstName U26
SYMBOL res 528 2720 R90
WINDOW 0 0 56 VBottom 2
WINDOW 3 32 56 VTop 2
SYMATTR InstName R39
SYMATTR Value 1k
SYMBOL res 640 2720 R90
WINDOW 0 0 56 VBottom 2
WINDOW 3 32 56 VTop 2
SYMATTR InstName R40
SYMATTR Value 30k
SYMBOL OpAmps\\UniversalOpAmp 1120 2944 R0
SYMATTR InstName U27
SYMBOL res 1056 2720 R90
WINDOW 0 0 56 VBottom 2
WINDOW 3 32 56 VTop 2
SYMATTR InstName R41
SYMATTR Value 1k
SYMBOL res 1168 2720 R90
WINDOW 0 0 56 VBottom 2
WINDOW 3 32 56 VTop 2
SYMATTR InstName R42
SYMATTR Value 25k
SYMBOL OpAmps\\UniversalOpAmp 816 2928 R0
SYMATTR InstName U28
SYMBOL OpAmps\\UniversalOpAmp 160 3440 R0
SYMATTR InstName U29
SYMBOL cap 0 3312 R0
WINDOW 3 22 -14 Left 2
SYMATTR InstName C17
SYMATTR Value 4.7n
SYMBOL cap 96 3408 R90
WINDOW 0 79 32 VBottom 2
WINDOW 3 32 32 VTop 2
SYMATTR InstName C18
SYMATTR Value 150p
SYMBOL res 0 3456 R0
WINDOW 0 39 98 Left 2
SYMATTR InstName R43
SYMATTR Value 110
SYMBOL res 96 3296 R0
WINDOW 3 32 15 Left 2
SYMATTR InstName R44
SYMATTR Value 200k
SYMBOL OpAmps\\UniversalOpAmp 592 3424 R0
SYMATTR InstName U30
SYMBOL res 528 3200 R90
WINDOW 0 0 56 VBottom 2
WINDOW 3 32 56 VTop 2
SYMATTR InstName R45
SYMATTR Value 1k
SYMBOL res 640 3200 R90
WINDOW 0 0 56 VBottom 2
WINDOW 3 32 56 VTop 2
SYMATTR InstName R46
SYMATTR Value 30k
SYMBOL OpAmps\\UniversalOpAmp 1120 3424 R0
SYMATTR InstName U31
SYMBOL res 1056 3200 R90
WINDOW 0 0 56 VBottom 2
WINDOW 3 32 56 VTop 2
SYMATTR InstName R47
SYMATTR Value 1k
SYMBOL res 1168 3200 R90
WINDOW 0 0 56 VBottom 2
WINDOW 3 32 56 VTop 2
SYMATTR InstName R48
SYMATTR Value 25k
SYMBOL OpAmps\\UniversalOpAmp 816 3408 R0
SYMATTR InstName U32
SYMBOL voltage -1120 576 R0
WINDOW 3 -108 52 Left 2
WINDOW 123 11 98 Left 2
WINDOW 39 0 0 Left 0
SYMATTR InstName V4
SYMATTR Value SINE(0 5m 40k)
SYMATTR Value2 AC 1
SYMBOL voltage -896 576 R0
WINDOW 3 -107 55 Left 2
WINDOW 123 11 98 Left 2
WINDOW 39 0 0 Left 0
SYMATTR InstName V5
SYMATTR Value SINE(0 5m 40k)
SYMATTR Value2 AC 1
SYMBOL voltage -672 576 R0
WINDOW 3 -101 56 Left 2
WINDOW 123 11 98 Left 2
WINDOW 39 0 0 Left 0
SYMATTR InstName V6
SYMATTR Value SINE(0 5m 40k)
SYMATTR Value2 AC 1
SYMBOL voltage -1344 1072 R0
WINDOW 3 -92 182 Left 2
WINDOW 123 11 98 Left 2
WINDOW 39 0 0 Left 0
SYMATTR InstName V7
SYMATTR Value SINE(0 5m 40k)
SYMATTR Value2 AC 1
SYMBOL voltage -1120 1072 R0
WINDOW 3 -92 182 Left 2
WINDOW 123 11 98 Left 2
WINDOW 39 0 0 Left 0
SYMATTR InstName V8
SYMATTR Value SINE(0 5m 40k)
SYMATTR Value2 AC 1
SYMBOL voltage -896 1072 R0
WINDOW 3 -92 182 Left 2
WINDOW 123 11 98 Left 2
WINDOW 39 0 0 Left 0
SYMATTR InstName V9
SYMATTR Value SINE(0 5m 40k)
SYMATTR Value2 AC 1
SYMBOL voltage -672 1072 R0
WINDOW 3 -92 182 Left 2
WINDOW 123 11 98 Left 2
WINDOW 39 0 0 Left 0
SYMATTR InstName V10
SYMATTR Value SINE(0 5m 40k)
SYMATTR Value2 AC 1
SYMBOL bv -1344 736 R0
WINDOW 3 59 59 Left 2
SYMATTR InstName B1
SYMATTR Value V=White(1E9*time)*0.005
SYMBOL res -16 528 R90
WINDOW 0 0 56 VBottom 2
WINDOW 3 32 56 VTop 2
SYMATTR InstName R49
SYMATTR Value 6.2k
SYMBOL res -32 48 R90
WINDOW 0 0 56 VBottom 2
WINDOW 3 32 56 VTop 2
SYMATTR InstName R50
SYMATTR Value 6.2k
SYMBOL res 0 1008 R90
WINDOW 0 0 56 VBottom 2
WINDOW 3 32 56 VTop 2
SYMATTR InstName R51
SYMATTR Value 6.2k
SYMBOL res 0 1488 R90
WINDOW 0 0 56 VBottom 2
WINDOW 3 32 56 VTop 2
SYMATTR InstName R52
SYMATTR Value 6.2k
SYMBOL res -16 1968 R90
WINDOW 0 0 56 VBottom 2
WINDOW 3 32 56 VTop 2
SYMATTR InstName R53
SYMATTR Value 6.2k
SYMBOL res 0 2448 R90
WINDOW 0 0 56 VBottom 2
WINDOW 3 32 56 VTop 2
SYMATTR InstName R54
SYMATTR Value 6.2k
SYMBOL res 0 2928 R90
WINDOW 0 0 56 VBottom 2
WINDOW 3 32 56 VTop 2
SYMATTR InstName R55
SYMATTR Value 6.2k
SYMBOL res 0 3408 R90
WINDOW 0 0 56 VBottom 2
WINDOW 3 32 56 VTop 2
SYMATTR InstName R56
SYMATTR Value 6.2k
SYMBOL OpAmps\\opamp2 160 16 R0
SYMATTR InstName U33
SYMATTR Value OPA350
SYMBOL OpAmps\\opamp2 592 0 R0
SYMATTR InstName U1
SYMATTR Value OPA350
SYMBOL OpAmps\\opamp2 816 -16 R0
SYMATTR InstName U2
SYMATTR Value OPA350
SYMBOL OpAmps\\opamp2 1120 0 R0
SYMATTR InstName U3
SYMATTR Value OPA350
SYMBOL OpAmps\\opamp2 1824 16 R0
WINDOW 3 -103 110 Left 2
SYMATTR InstName U4
SYMATTR Value OPA350
SYMBOL OpAmps\\opamp2 2064 0 R0
SYMATTR InstName U34
SYMATTR Value OPA350
SYMBOL diode 1872 96 R270
WINDOW 0 32 32 VTop 2
WINDOW 3 0 32 VBottom 2
SYMATTR InstName D1
SYMATTR Value 1N4148
SYMBOL res 1728 48 R90
WINDOW 0 0 56 VBottom 2
WINDOW 3 32 56 VTop 2
SYMATTR InstName R57
SYMATTR Value 1k
SYMBOL res 1872 -64 R90
WINDOW 0 0 56 VBottom 2
WINDOW 3 32 56 VTop 2
SYMATTR InstName R58
SYMATTR Value 1k
SYMBOL OpAmps\\opamp2 1424 0 R0
SYMATTR InstName U35
SYMATTR Value OPA350
TEXT -8 256 Left 2 ;BPF
TEXT 360 256 Left 2 ;Amplifier
TEXT -568 -100 Left 2 !.tran 1m
TEXT -8 736 Left 2 ;BPF
TEXT 360 736 Left 2 ;Amplifier
TEXT -8 1216 Left 2 ;BPF
TEXT 360 1216 Left 2 ;Amplifier
TEXT -8 1696 Left 2 ;BPF
TEXT 360 1696 Left 2 ;Amplifier
TEXT -8 2176 Left 2 ;BPF
TEXT 360 2176 Left 2 ;Amplifier
TEXT -8 2656 Left 2 ;BPF
TEXT 360 2656 Left 2 ;Amplifier
TEXT -8 3136 Left 2 ;BPF
TEXT 360 3136 Left 2 ;Amplifier
TEXT -8 3616 Left 2 ;BPF
TEXT 360 3616 Left 2 ;Amplifier
TEXT -304 688 Left 2 !;ac lin 10K 10K 100K
TEXT 3648 -328 Left 2 !* OPA350 SPICE Macro-model              3/31/99, Rev. B   by Marek Lis\n* Rev. A  12/18/98,  by Marek Lis\n* REV. B  23 DEC 1998 NEIL ALBAUGH; REVISED CONNECTION NAMES TO MATCH SYMBOL\n* Rev. C  3/31/99,  by Marek Lis: added voltage and current noise (1/f noise is NOT modeled.)\n* REV. D  1 APR 1999 NEIL ALBAUGH; REVISED CONNECTION NAMES TO MATCH SYMBOL\n*\n*\n*\n*\n*\n* Copyright 1997 by Burr-Brown Corporation\n \n*\n \n*                non-inverting input\n \n*                |  inverting input\n \n*                |  |  positive supply\n \n*                |  |  |   negative supply\n \n*                |  |  |   |   output\n \n*                |  |  |   |   |\n \n.SUBCKT OPA350   +  -  V+  V-  OUT\n \n* INPUT STAGE\n \n*\n \ni1 V+ 5 400u\n \nm7 550 vswitch 5 5 pix l=2u w=25u m=26\n \nm8 550 550 V- V- nix l=2u w=25u m=26\n \nm9 553a 550 V- V- nix l=2u w=25u m=26\n \nm9c 66 nvsat 553a V- nix l=2u w=25u m=26\n \nVpvsat V+ vswitch DC 1.8\n \nVnvsat nvsat V- DC 1.37\n \niin1 + 98 .5p\n \niin2 - 98 .5p\n \nd3 5 V+ dx\n \nd4 V- 66 dx\n \nd5 - V+ dx\n \nd6 + V+ dx\n \nd7 V- - dx\n \nd8 V- + dx\n \nrinp 7 7a 500\n \nrinn - 2a 500\n \nm1 33 2a 66 V- nix l=2u w=25u m=13\n \nm2 4 7a 66 V- nix l=2u w=25u m=13\n \nm3 8 2a 5 5 pix l=2u w=25u m=13\n \nm4 9 7a 5 5 pix l=2u w=25u m=13\n \neos 7 + poly(1) 25 98 0 0\n \nios - + 0p\n \nr1 V+ 33x 4.833k\n \nr2 V+ 4x 4.833k\n \nr3 8x V- 4.833k\n \nr4 9x V- 4.833k\n \nvr1 33 33x DC 2\n \nvr2 4 4x DC 2\n \nvr3 8x 8 DC 2\n \nvr4 9x 9 DC 2\n \ni1a V+ V- 2464u\n \n*\n \n* GAIN STAGE\n \n*\n \neref 98 0 poly(2) V+ 0 V- 0 0 0.5 0.5\n \ng1 98 21 poly(2) 4 33 9 8 0 145u 145u\n \nrg 21 98 2.3e6\n \ncc 21 6c 10.6pF\n \nrcc 6c OUT 2.4k\n \nd1 21 22 dx\n \nd2 23 21 dx\n \nv1 V+ 22 1.37\n \nv2 23 V- 1.37\n \n\n*\n \n* COMMON MODE GAIN STAGE\n \n*\n \necm 24 98 poly(2) + 98 - 98 0 0.5 0.5\n \nr5 24 25 1e6\n \nr6 25 98 10k\n \nc1 24 25 0.75p\n \n*\n \n* OUTPUT STAGE\n \n*\n \nisy V+ V- 540.4u\n \ngsy V+ V- poly(1) V+ V- -3.334e-4 6.667e-5\n \nep V+ 39 poly(1) 98 21 0.78925 1\n \nen 38 V- poly(1) 21 98 0.78925 1\n \nvh OUT 6h DC -2.4e-2\n \nvl 6l OUT DC -2.4e-2 \n \nm113 6h 39 V+ V+ pox l=1.5u w=1500u m=12\n \nm114 6l 38 V- V- nox l=1.5u w=1500u m=12\n \nc15 OUT 39 15p\n \nc16 OUT 38 15p\n \n.model dx d(rs=1 cjo=0.1p)\n \n.model nix nmos(vto=0.75 kp=205.5u rd=1 rs=1 rg=1 rb=1 cgso=4e-9\n \n+cgdo=4e-9 cgbo=16.667e-9 cbs=2.34e-13 cbd=2.34e-13)\n \n.model nox nmos(vto=0.75 kp=195u rd=.5 rs=.5 rg=1 rb=1 cgso=66.667e-12\n \n+cgdo=66.667e-12 cgbo=125e-9 cbs=2.34e-13 cbd=2.34e-13)\n \n.model pix pmos(vto=-0.75 kp=205.5u rd=1 rs=1 rg=1 rb=1 cgso=4e-9\n \n+cgdo=4e-9 cgbo=16.667e-9 cbs=2.34e-13 cbd=2.34e-13)\n \n.model pox pmos(vto=-0.75 kp=195u rd=.5 rs=.5 rg=1 rb=1 cgso=66.667e-12\n \n+cgdo=66.667e-12 cgbo=125e-9 cbs=2.34e-13 cbd=2.34e-13)\n \n.ENDS OPA350
RECTANGLE Normal 352 272 -16 -208 2
RECTANGLE Normal 1280 272 352 -208 2
RECTANGLE Normal 352 752 -16 272 2
RECTANGLE Normal 1280 752 352 272 2
RECTANGLE Normal 352 1232 -16 752 2
RECTANGLE Normal 1280 1232 352 752 2
RECTANGLE Normal 352 1712 -16 1232 2
RECTANGLE Normal 1280 1712 352 1232 2
RECTANGLE Normal 352 2192 -16 1712 2
RECTANGLE Normal 1280 2192 352 1712 2
RECTANGLE Normal 352 2672 -16 2192 2
RECTANGLE Normal 1280 2672 352 2192 2
RECTANGLE Normal 352 3152 -16 2672 2
RECTANGLE Normal 1280 3152 352 2672 2
RECTANGLE Normal 352 3632 -16 3152 2
RECTANGLE Normal 1280 3632 352 3152 2

The netlist it stands for:
* V00_CircuitDiagram.asc
C1 BP_out N009 4.7n
C2 N010 N009 150p
R1 N009 0 110
R2 BP_out N010 200k
V2 V+ 0 3.3
V3 0 V- 3.3
C3 0 V- 4.7n
C4 V+ 0 4.7n
R3 N001 0 1k
R4 N002 N001 22k
R5 N004 0 1k
R6 Amp_out N004 22k
V1 Mic0_out N020 SINE(0 5m 40k) AC 1
XU5 0 N019 V+ V- N012 level1 Avol=1Meg GBW=10Meg Vos=0 En=0 Enk=0 In=0 Ink=0 Rin=500Meg  ; pins In+ In- V+ V- OUT
C5 N012 N018 4.7n
C6 N019 N018 150p
R7 N018 0 110
R8 N012 N019 200k
XU6 N012 N013 V+ V- N014 level1 Avol=1Meg GBW=10Meg Vos=0 En=0 Enk=0 In=0 Ink=0 Rin=500Meg  ; pins In+ In- V+ V- OUT
R9 N013 0 1k
R10 N014 N013 27k
XU7 N015 N016 V+ V- N017 level1 Avol=1Meg GBW=10Meg Vos=0 En=0 Enk=0 In=0 Ink=0 Rin=500Meg  ; pins In+ In- V+ V- OUT
R11 N016 0 1k
R12 N017 N016 27k
XU8 N014 N015 V+ V- N015 level1 Avol=1Meg GBW=10Meg Vos=0 En=0 Enk=0 In=0 Ink=0 Rin=500Meg  ; pins In+ In- V+ V- OUT
XU9 0 N028 V+ V- N021 level1 Avol=1Meg GBW=10Meg Vos=0 En=0 Enk=0 In=0 Ink=0 Rin=500Meg  ; pins In+ In- V+ V- OUT
C7 N021 N027 4.7n
C8 N028 N027 150p
R13 N027 0 110
R14 N021 N028 200k
XU10 N021 N022 V+ V- N023 level1 Avol=1Meg GBW=10Meg Vos=0 En=0 Enk=0 In=0 Ink=0 Rin=500Meg  ; pins In+ In- V+ V- OUT
R15 N022 0 1k
R16 N023 N022 30k
XU11 N024 N025 V+ V- N026 level1 Avol=1Meg GBW=10Meg Vos=0 En=0 Enk=0 In=0 Ink=0 Rin=500Meg  ; pins In+ In- V+ V- OUT
R17 N025 0 1k
R18 N026 N025 25k
XU12 N023 N024 V+ V- N024 level1 Avol=1Meg GBW=10Meg Vos=0 En=0 Enk=0 In=0 Ink=0 Rin=500Meg  ; pins In+ In- V+ V- OUT
XU13 0 N036 V+ V- N029 level1 Avol=1Meg GBW=10Meg Vos=0 En=0 Enk=0 In=0 Ink=0 Rin=500Meg  ; pins In+ In- V+ V- OUT
C9 N029 N035 4.7n
C10 N036 N035 150p
R19 N035 0 110
R20 N029 N036 200k
XU14 N029 N030 V+ V- N031 level1 Avol=1Meg GBW=10Meg Vos=0 En=0 Enk=0 In=0 Ink=0 Rin=500Meg  ; pins In+ In- V+ V- OUT
R21 N030 0 1k
R22 N031 N030 30k
XU15 N032 N033 V+ V- N034 level1 Avol=1Meg GBW=10Meg Vos=0 En=0 Enk=0 In=0 Ink=0 Rin=500Meg  ; pins In+ In- V+ V- OUT
R23 N033 0 1k
R24 N034 N033 25k
XU16 N031 N032 V+ V- N032 level1 Avol=1Meg GBW=10Meg Vos=0 En=0 Enk=0 In=0 Ink=0 Rin=500Meg  ; pins In+ In- V+ V- OUT
XU17 0 N044 V+ V- N037 level1 Avol=1Meg GBW=10Meg Vos=0 En=0 Enk=0 In=0 Ink=0 Rin=500Meg  ; pins In+ In- V+ V- OUT
C11 N037 N043 4.7n
C12 N044 N043 150p
R25 N043 0 110
R26 N037 N044 200k
XU18 N037 N038 V+ V- N039 level1 Avol=1Meg GBW=10Meg Vos=0 En=0 Enk=0 In=0 Ink=0 Rin=500Meg  ; pins In+ In- V+ V- OUT
R27 N038 0 1k
R28 N039 N038 30k
XU19 N040 N041 V+ V- N042 level1 Avol=1Meg GBW=10Meg Vos=0 En=0 Enk=0 In=0 Ink=0 Rin=500Meg  ; pins In+ In- V+ V- OUT
R29 N041 0 1k
R30 N042 N041 25k
XU20 N039 N040 V+ V- N040 level1 Avol=1Meg GBW=10Meg Vos=0 En=0 Enk=0 In=0 Ink=0 Rin=500Meg  ; pins In+ In- V+ V- OUT
XU21 0 N052 V+ V- N045 level1 Avol=1Meg GBW=10Meg Vos=0 En=0 Enk=0 In=0 Ink=0 Rin=500Meg  ; pins In+ In- V+ V- OUT
C13 N045 N051 4.7n
C14 N052 N051 150p
R31 N051 0 110
R32 N045 N052 200k
XU22 N045 N046 V+ V- N047 level1 Avol=1Meg GBW=10Meg Vos=0 En=0 Enk=0 In=0 Ink=0 Rin=500Meg  ; pins In+ In- V+ V- OUT
R33 N046 0 1k
R34 N047 N046 30k
XU23 N048 N049 V+ V- N050 level1 Avol=1Meg GBW=10Meg Vos=0 En=0 Enk=0 In=0 Ink=0 Rin=500Meg  ; pins In+ In- V+ V- OUT
R35 N049 0 1k
R36 N050 N049 25k
XU24 N047 N048 V+ V- N048 level1 Avol=1Meg GBW=10Meg Vos=0 En=0 Enk=0 In=0 Ink=0 Rin=500Meg  ; pins In+ In- V+ V- OUT
XU25 0 N060 V+ V- N053 level1 Avol=1Meg GBW=10Meg Vos=0 En=0 Enk=0 In=0 Ink=0 Rin=500Meg  ; pins In+ In- V+ V- OUT
C15 N053 N059 4.7n
C16 N060 N059 150p
R37 N059 0 110
R38 N053 N060 200k
XU26 N053 N054 V+ V- N055 level1 Avol=1Meg GBW=10Meg Vos=0 En=0 Enk=0 In=0 Ink=0 Rin=500Meg  ; pins In+ In- V+ V- OUT
R39 N054 0 1k
R40 N055 N054 30k
XU27 N056 N057 V+ V- N058 level1 Avol=1Meg GBW=10Meg Vos=0 En=0 Enk=0 In=0 Ink=0 Rin=500Meg  ; pins In+ In- V+ V- OUT
R41 N057 0 1k
R42 N058 N057 25k
XU28 N055 N056 V+ V- N056 level1 Avol=1Meg GBW=10Meg Vos=0 En=0 Enk=0 In=0 Ink=0 Rin=500Meg  ; pins In+ In- V+ V- OUT
XU29 0 N068 V+ V- N061 level1 Avol=1Meg GBW=10Meg Vos=0 En=0 Enk=0 In=0 Ink=0 Rin=500Meg  ; pins In+ In- V+ V- OUT
C17 N061 N067 4.7n
C18 N068 N067 150p
R43 N067 0 110
R44 N061 N068 200k
XU30 N061 N062 V+ V- N063 level1 Avol=1Meg GBW=10Meg Vos=0 En=0 Enk=0 In=0 Ink=0 Rin=500Meg  ; pins In+ In- V+ V- OUT
R45 N062 0 1k
R46 N063 N062 30k
XU31 N064 N065 V+ V- N066 level1 Avol=1Meg GBW=10Meg Vos=0 En=0 Enk=0 In=0 Ink=0 Rin=500Meg  ; pins In+ In- V+ V- OUT
R47 N065 0 1k
R48 N066 N065 25k
XU32 N063 N064 V+ V- N064 level1 Avol=1Meg GBW=10Meg Vos=0 En=0 Enk=0 In=0 Ink=0 Rin=500Meg  ; pins In+ In- V+ V- OUT
V4 Mic1_out N020 SINE(0 5m 40k) AC 1
V5 Mic2_out N020 SINE(0 5m 40k) AC 1
V6 Mic3_out N020 SINE(0 5m 40k) AC 1
V7 Mic4_out N020 SINE(0 5m 40k) AC 1
V8 Mic5_out N020 SINE(0 5m 40k) AC 1
V9 Mic6_out N020 SINE(0 5m 40k) AC 1
V10 Mic7_out N020 SINE(0 5m 40k) AC 1
B1 N020 0 V=White(1E9*time)*0.005
R49 N018 Mic1_out 6.2k
R50 N009 Mic0_out 6.2k
R51 N027 Mic2_out 6.2k
R52 N035 Mic3_out 6.2k
R53 N043 Mic4_out 6.2k
R54 N051 Mic5_out 6.2k
R55 N059 Mic6_out 6.2k
R56 N067 Mic7_out 6.2k
XU33 0 N010 V+ V- BP_out OPA350  ; pins In+ In- V+ V- OUT
XU1 BP_out N001 V+ V- N002 OPA350  ; pins In+ In- V+ V- OUT
XU2 N002 N003 V+ V- N003 OPA350  ; pins In+ In- V+ V- OUT
XU3 N003 N004 V+ V- Amp_out OPA350  ; pins In+ In- V+ V- OUT
XU4 0 N006 V+ 0 N011 OPA350  ; pins In+ In- V+ V- OUT
XU34 N007 N008 V+ 0 N008 OPA350  ; pins In+ In- V+ V- OUT
D1 N011 N007 1N4148
R57 N006 N005 1k
R58 N007 N006 1k
XU35 Amp_out N005 V+ V- N005 OPA350  ; pins In+ In- V+ V- OUT
.model D D
.lib standard.dio
* BPF
* Amplifier
.tran 1m
* BPF
* Amplifier
* BPF
* Amplifier
* BPF
* Amplifier
* BPF
* Amplifier
* BPF
* Amplifier
* BPF
* Amplifier
* BPF
* Amplifier
;ac lin 10K 10K 100K
* OPA350 SPICE Macro-model              3/31/99, Rev. B   by Marek Lis
* Rev. A  12/18/98,  by Marek Lis
* REV. B  23 DEC 1998 NEIL ALBAUGH; REVISED CONNECTION NAMES TO MATCH SYMBOL
* Rev. C  3/31/99,  by Marek Lis: added voltage and current noise (1/f noise is NOT modeled.)
* REV. D  1 APR 1999 NEIL ALBAUGH; REVISED CONNECTION NAMES TO MATCH SYMBOL
*
*
*
*
*
* Copyright 1997 by Burr-Brown Corporation
*
*                non-inverting input
*                |  inverting input
*                |  |  positive supply
*                |  |  |   negative supply
*                |  |  |   |   output
*                |  |  |   |   |
.SUBCKT OPA350   +  -  V+  V-  OUT
* INPUT STAGE
*
i1 V+ 5 400u
m7 550 vswitch 5 5 pix l=2u w=25u m=26
m8 550 550 V- V- nix l=2u w=25u m=26
m9 553a 550 V- V- nix l=2u w=25u m=26
m9c 66 nvsat 553a V- nix l=2u w=25u m=26
Vpvsat V+ vswitch DC 1.8
Vnvsat nvsat V- DC 1.37
iin1 + 98 .5p
iin2 - 98 .5p
d3 5 V+ dx
d4 V- 66 dx
d5 - V+ dx
d6 + V+ dx
d7 V- - dx
d8 V- + dx
rinp 7 7a 500
rinn - 2a 500
m1 33 2a 66 V- nix l=2u w=25u m=13
m2 4 7a 66 V- nix l=2u w=25u m=13
m3 8 2a 5 5 pix l=2u w=25u m=13
m4 9 7a 5 5 pix l=2u w=25u m=13
eos 7 + poly(1) 25 98 0 0
ios - + 0p
r1 V+ 33x 4.833k
r2 V+ 4x 4.833k
r3 8x V- 4.833k
r4 9x V- 4.833k
vr1 33 33x DC 2
vr2 4 4x DC 2
vr3 8x 8 DC 2
vr4 9x 9 DC 2
i1a V+ V- 2464u
*
* GAIN STAGE
*
eref 98 0 poly(2) V+ 0 V- 0 0 0.5 0.5
g1 98 21 poly(2) 4 33 9 8 0 145u 145u
rg 21 98 2.3e6
cc 21 6c 10.6pF
rcc 6c OUT 2.4k
d1 21 22 dx
d2 23 21 dx
v1 V+ 22 1.37
v2 23 V- 1.37
*
* COMMON MODE GAIN STAGE
*
ecm 24 98 poly(2) + 98 - 98 0 0.5 0.5
r5 24 25 1e6
r6 25 98 10k
c1 24 25 0.75p
*
* OUTPUT STAGE
*
isy V+ V- 540.4u
gsy V+ V- poly(1) V+ V- -3.334e-4 6.667e-5
ep V+ 39 poly(1) 98 21 0.78925 1
en 38 V- poly(1) 21 98 0.78925 1
vh OUT 6h DC -2.4e-2
vl 6l OUT DC -2.4e-2
m113 6h 39 V+ V+ pox l=1.5u w=1500u m=12
m114 6l 38 V- V- nox l=1.5u w=1500u m=12
c15 OUT 39 15p
c16 OUT 38 15p
.model dx d(rs=1 cjo=0.1p)
.model nix nmos(vto=0.75 kp=205.5u rd=1 rs=1 rg=1 rb=1 cgso=4e-9
+cgdo=4e-9 cgbo=16.667e-9 cbs=2.34e-13 cbd=2.34e-13)
.model nox nmos(vto=0.75 kp=195u rd=.5 rs=.5 rg=1 rb=1 cgso=66.667e-12
+cgdo=66.667e-12 cgbo=125e-9 cbs=2.34e-13 cbd=2.34e-13)
.model pix pmos(vto=-0.75 kp=205.5u rd=1 rs=1 rg=1 rb=1 cgso=4e-9
+cgdo=4e-9 cgbo=16.667e-9 cbs=2.34e-13 cbd=2.34e-13)
.model pox pmos(vto=-0.75 kp=195u rd=.5 rs=.5 rg=1 rb=1 cgso=66.667e-12
+cgdo=66.667e-12 cgbo=125e-9 cbs=2.34e-13 cbd=2.34e-13)
.ENDS OPA350
.lib UniversalOpAmp1.lib
.backanno
.end